# EAGLE design BreakoutBoardSFH (EAGLE 8.4.2)
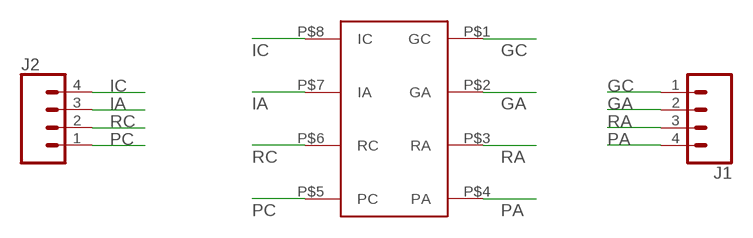
[diagram p0: schematic, sheet 1]

## Parts
J1  CONN_04  [1X04]
J2  CONN_04  [1X04]
U1  SFH7050  [SFH7050]

## Nets
GA: J1.2 U1.P$2(GA)
GC: J1.1 U1.P$1(GC)
IA: J2.3 U1.P$7(IA)
IC: J2.4 U1.P$8(IC)
PA: J1.4 U1.P$4(PA)
PC: J2.1 U1.P$5(PC)
RA: J1.3 U1.P$3(RA)
RC: J2.2 U1.P$6(RC)

## Library data of the parts
J1 J2 = SparkFun-Connectors:CONN_04: Multi connection point. Often used as Generic Header-pin footprint for 0.1 inch spaced/style header connections On any of the 0.1 inch spaced packages, you can populate with these: Break Away Headers - Straight <https://www.sparkfun.com/products/116> (PRT-00116) Break Away Male Headers - Right Angle <https://www.sparkfun.com/products/553> (PRT-00553) Female Headers <https://www.sparkfun.com/products/115> (PRT-00115) Break Away Headers - Machine Pin <https://www.sparkfun.com/products/117> (PRT-00117) Break Away Female Headers - Swiss Machine Pin <https://www.sparkfun.com/products/743> (PRT-00743) For SCREWTERMINALS and SPRING TERMINALS visit here: Screw Terimnals on SparkFun.com <https://www.sparkfun.com/search/results?term=Screw+Terminals> (5mm/3.5mm/2.54mm spacing) This device is also useful as a general connection point to wire up your design to another part of your project. Our various solder wires solder well into these plated through hole pads. Hook-Up Wire - Assortment (Stranded, 22 AWG) <https://www.sparkfun.com/products/11375> (PRT-11375) Hook-Up Wire - Assortment (Solid Core, 22 AWG) <https://www.sparkfun.com/products/11367> (PRT-11367) View the entire wire category on our website here <https://www.sparkfun.com/categories/141> Special notes: Molex polarized connector foot print use with SKU : PRT-08231 with associated crimp pins and housings. 1MM SMD Version SKU: PRT-10208; PROD_ID: CONN-09696
U1 = CustomLibrary:SFH7050

## Board
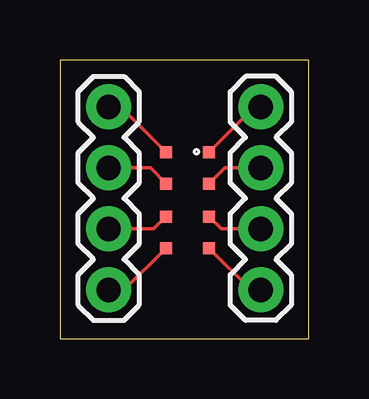
[diagram p1: board, top side]
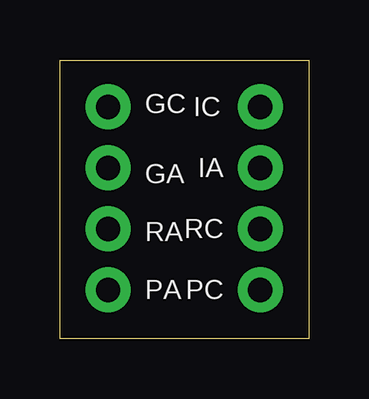
[diagram p2: board, bottom side, seen from below]

Size 10.39 x 11.61 mm. Coordinates in mm from the lower left corner, seen from the top.
Outline: 0,0 10.39,0 10.39,11.61 0,11.61 0,0
Copper layers (1*16): Top 0.035mm / dielectric 1.5mm / Bottom 0.035mm
Design rules "default": minimum track width 6mil, minimum drill 0.35mm, track to track 6mil, track to pad 6mil, pad to pad 6mil, via to via 6mil, smd to smd 6mil, copper to edge 40mil, drill to drill 6mil, minimum pad ring 10mil, minimum via ring 8mil, stop-mask expansion 4mil, vias tented up to drill 0mil, thermal gap 10mil

### Footprints (pad centres in the part's own frame; a part is rotated, then mirrored left to right if it is on the bottom)
1X04 = drill 1.016 pad 1.88: 1 0,0; 2 2.54,0; 3 5.08,0; 4 7.62,0
SFH7050 = smd 0.5 x 0.5: P$1 -1.928,0.889; P$2 -0.618,0.889; P$3 0.762,0.889; P$4 2.072,0.889; P$5 2.072,-0.911; P$6 0.762,-0.911; P$7 -0.618,-0.911; P$8 -1.928,-0.911

### Placement (x,y rotation side)
J1  8.38,9.65 270 top
J2  2.03,2.03 90 top
U1  5.33,5.84 270 top

### Tracks (layer width: path | path; a pad name or v marks a point on that pad's centre or on a via)
GA
  Top 0.152: J1.2 6.88,7.11 U1.P$2
GC
  Top 0.152: J1.1 8.11,9.65 U1.P$1
IA
  Top 0.152: J2.3 3.77,7.11 U1.P$7
IC
  Top 0.152: J2.4 2.54,9.65 U1.P$8
PA
  Top 0.152: J1.4 7.96,2.03 U1.P$4
PC
  Top 0.152: J2.1 2.69,2.03 U1.P$5
RA
  Top 0.152: J1.3 6.73,4.57 U1.P$3
RC
  Top 0.152: J2.2 3.92,4.57 U1.P$6

### Text on the board
bPlace: IC | GC | IA | GA | RC | RA | PC | PA